# EAGLE design TDA2822M (EAGLE 7.0.0)
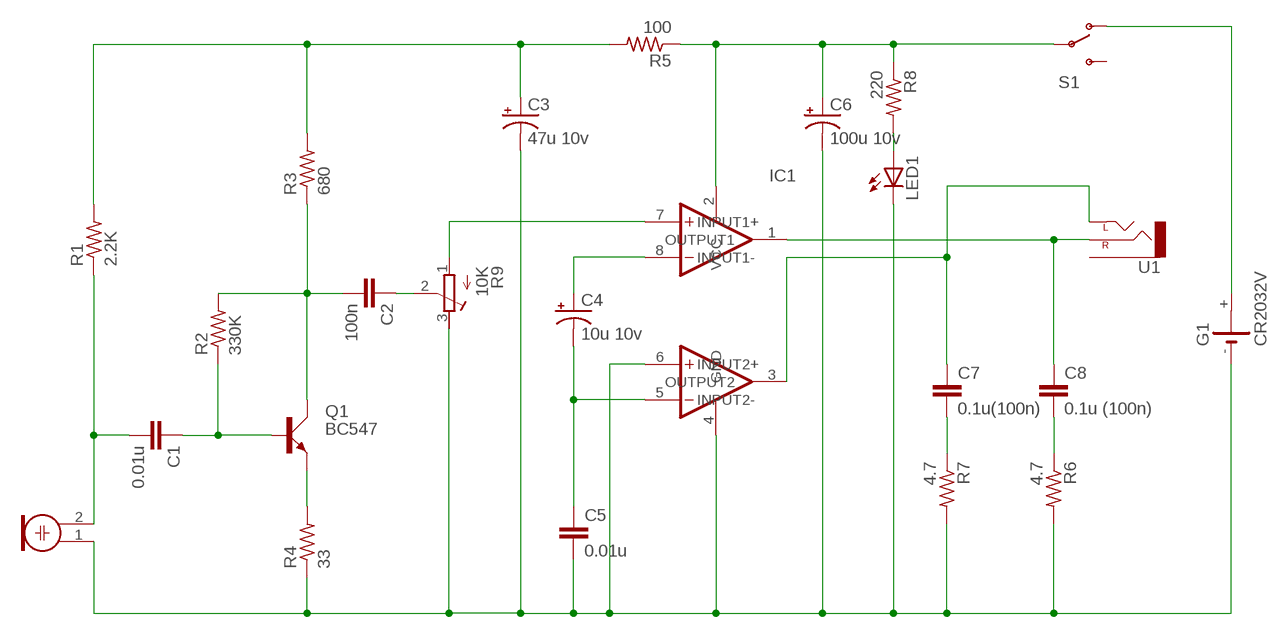
[diagram p0: schematic, sheet 1]

## Parts
C1  0.01u  CAPPTH  [CAP-PTH-SMALL]
C2  100n  CAPPTH  [CAP-PTH-SMALL]
C3  47u 10v  CAP_POLPTH2  [CPOL-RADIAL-10UF-25V]
C4  10u 10v  CAP_POLPTH2  [CPOL-RADIAL-10UF-25V]
C5  0.01u  CAPPTH  [CAP-PTH-SMALL]
C6  100u 10v  CAP_POLPTH2  [CPOL-RADIAL-10UF-25V]
C7  0.1u(100n)  CAPPTH  [CAP-PTH-SMALL]
C8  0.1u (100n)  CAPPTH  [CAP-PTH-SMALL]
G1  CR2032V  [CR2032V]
IC1  TDA2822M  [DIL8]
LED1  LED3MM  [LED3MM]
M1  ELECTRET_MICROPHON-F6035AP  [F6035AP]
Q1  BC547  [SOT54A]
R1  2.2K  R-US_0204/7  [0204/7]
R2  330K  R-US_0204/7  [0204/7]
R3  680  R-US_0204/7  [0204/7]
R4  33  R-US_0204/7  [0204/7]
R5  100  R-US_0204/7  [0204/7]
R6  4.7  R-US_0204/7  [0204/7]
R7  4.7  R-US_0204/7  [0204/7]
R8  220  R-US_0204/7  [0204/7]
R9  10K  R-TRIMM3339P  [RTRIM3339P]
S1  SWITCH-SPSTKIT  [SWITCH-SPDT_KIT]
U1  AUDIO-JACKPTH  [AUDIO-JACK]

## Nets
GND: C3.2(-) C5.2 C6.2(-) G1.- IC1.4(GND) IC1.6(INPUT2+) LED1.K(C) M1.1 R4.1 R6.2 R7.2 R9.3(A)
N$1: C3.1(+) R1.2 R3.2 R5.2
N$2: C2.2 Q1.C R2.2 R3.1
N$3: C1.2 M1.2 R1.1
N$5: Q1.E R4.2
N$6: C2.1 R9.2(S)
N$8: C4.2(-) C5.1 IC1.5(INPUT2-)
N$9: C7.2 R7.1
N$10: C8.2 R6.1
N$11: LED1.A R8.2
N$12: C6.1(+) IC1.2(VCC) R5.1 R8.1 S1.2(P)
N$13: C8.1 IC1.1(OUTPUT1) U1.RING(RIGHT)
N$15: C1.1 Q1.B R2.1
N$16: C4.1(+) IC1.8(INPUT1-)
N$17: IC1.7(INPUT1+) R9.1(E)
N$18: C7.1 IC1.3(OUTPUT2) U1.TIP(LEFT)
VCC: G1.+ S1.1(O)
Unconnected: G1.+@1(+) S1.3(S) U1.SLEEVE

## Library data of the parts
C1 C2 C5 C7 C8 = SparkFun:CAP: Capacitor Standard 0603 ceramic capacitor, and 0.1" leaded capacitor.
C3 C4 C6 = SparkFun:CAP_POL: Capacitor Polarized These are standard SMD and PTH capacitors. Normally 10uF, 47uF, and 100uF in electrolytic and tantalum varieties. Always verify the external diameter of the through hole cap, it varies with capacity, voltage, and manufacturer. The EIA devices should be standard.
G1 = battery:CR2032V: LI BATTERY Varta
IC1 = TDA2822M:TDA2822M: TDA2822M - DUAL LOW-VOLTAGE POWER AMPLIFIER
LED1 = adafruit:LED: LED OSRAM: - CHIPLED LG R971, LG N971, LY N971, LG Q971, LY Q971, LO R971, LY R971 LH N974, LH R974 LS Q976, LO Q976, LY Q976 LO Q996 - Hyper CHIPLED LW Q18S LB Q993, LB Q99A, LB R99A - SideLED LS A670, LO A670, LY A670, LG A670, LP A670 LB A673, LV A673, LT A673, LW A673 LH A674 LY A675 LS A676, LA A676, LO A676, LY A676, LW A676 LS A679, LY A679, LG A679 - Hyper Micro SIDELED® LS Y876, LA Y876, LO Y876, LY Y876 LT Y87S - SmartLED LW L88C, LW L88S LB L89C, LB L89S, LG L890 LS L89K, LO L89K, LY L89K LS L896, LA L896, LO L896, LY L896 - TOPLED LS T670, LO T670, LY T670, LG T670, LP T670 LSG T670, LSP T670, LSY T670, LOP T670, LYG T670 LG T671, LOG T671, LSG T671 LB T673, LV T673, LT T673, LW T673 LH T674 LS T676, LA T676, LO T676, LY T676, LB T676, LH T676, LSB T676, LW T676 LB T67C, LV T67C, LT T67C, LS T67K, LO T67K, LY T67K, LW E67C LS E67B, LA E67B, LO E67B, LY E67B, LB E67C, LV E67C, LT E67C LW T67C LS T679, LY T679, LG T679 LS T770, LO T770, LY T770, LG T770, LP T770 LB T773, LV T773, LT T773, LW T773 LH T774 LS E675, LA E675, LY E675, LS T675 LS T776, LA T776, LO T776, LY T776, LB T776 LHGB T686 LT T68C, LB T68C - Hyper Mini TOPLED® LB M676 - Mini TOPLED Santana® LG M470 LS M47K, LO M47K, LY M47K Source: http://www.osram.convergy.de/
M1 = microphon:ELECTRET_MICROPHON-: Electret Condenser Microphone
Q1 = transistor-small-signal:BC547: NPN TRANSISTOR
R1-R8 = adafruit:R-US_: RESISTOR, American symbol
R9 = resistor:R-TRIMM: Trimm resistor
S1 = SparkFun:SWITCH-SPST: SPST Switch Simple slide switch. Spark Fun Electronics SKU : COM-00102
U1 = SparkFun:AUDIO-JACK: 3.5mm Audio Jack Simple 3.5mm common PCB mount audio jack. SKU: PRT-08032

## Net classes
0 default: width 0.762 mm, drill 0.508 mm, clearance 0.762 mm

## Board
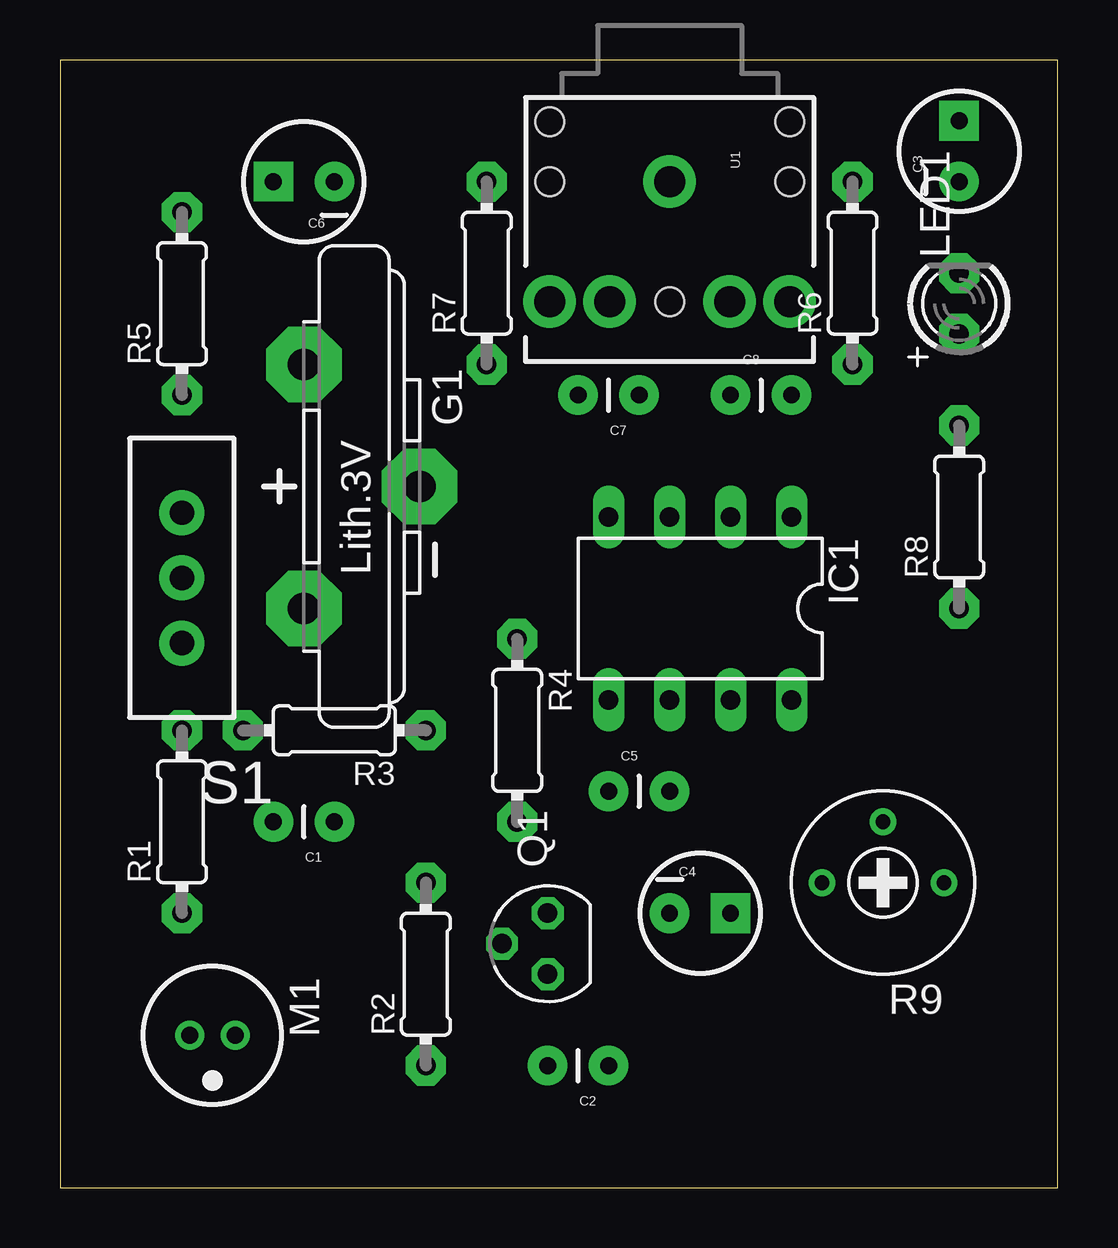
[diagram p1: board, top side]
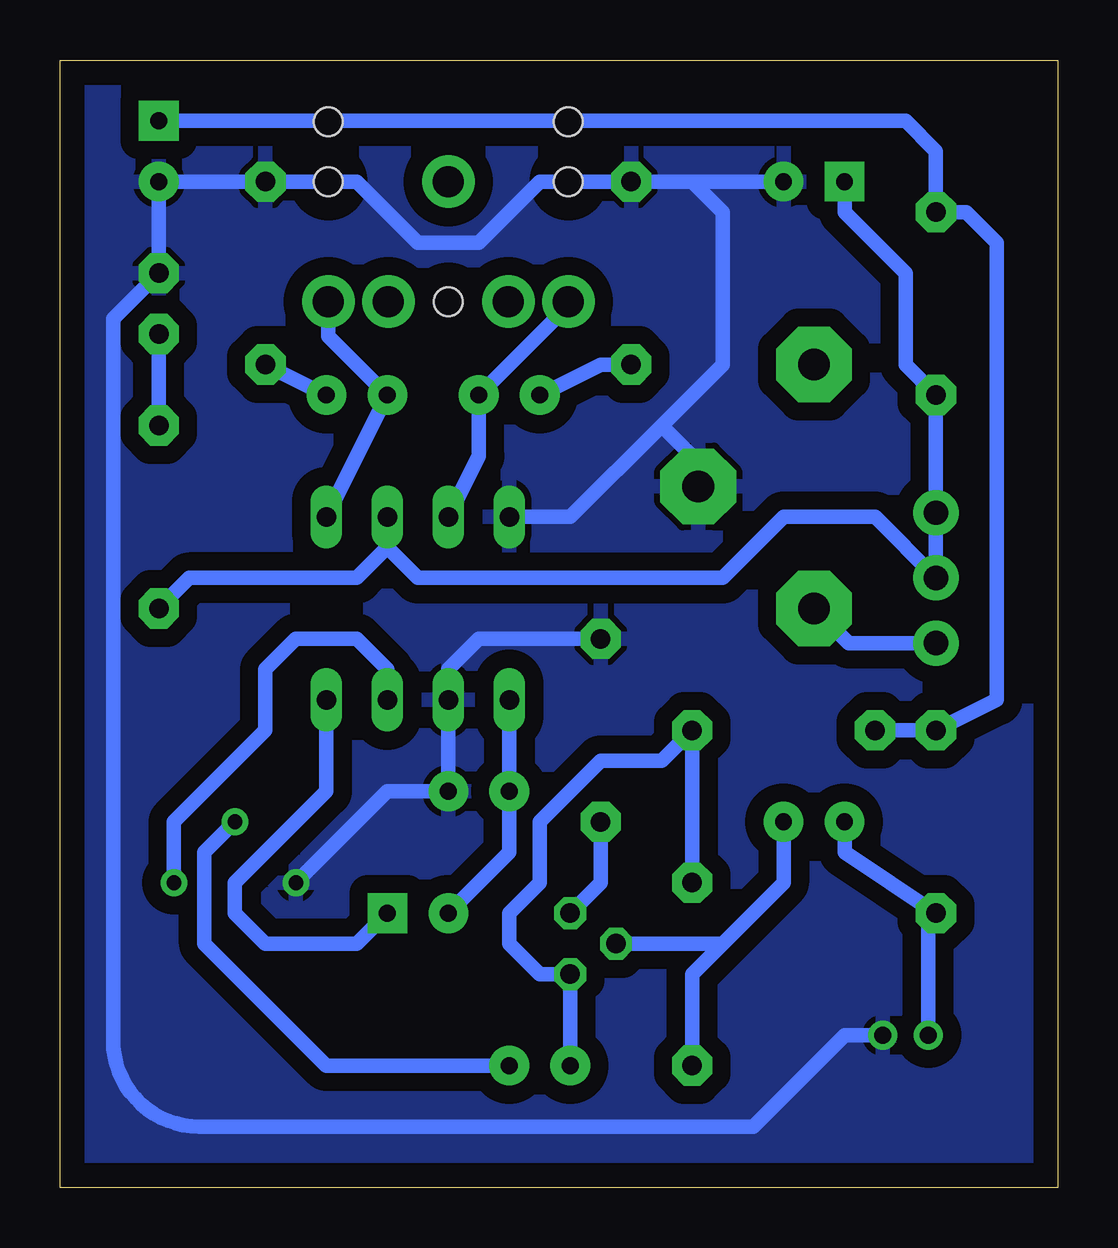
[diagram p2: board, bottom side, seen from below]

Size 41.58 x 46.98 mm. Coordinates in mm from the lower left corner, seen from the top.
Outline: 0,0 41.58,0 41.58,46.98 0,46.98 0,0
Copper layers (1*16): Top 0.035mm / dielectric 1.5mm / Bottom 0.035mm
Design rules "default *": minimum track width 12mil, minimum drill 24mil, track to track 8mil, track to pad 8mil, pad to pad 8mil, via to via 8mil, smd to smd 8mil, copper to edge 40mil, drill to drill 8mil, minimum pad ring 10mil, minimum via ring 8mil, stop-mask expansion 4mil, vias tented up to drill 0mil, thermal gap 10mil

### Footprints (pad centres in the part's own frame; a part is rotated, then mirrored left to right if it is on the bottom)
CAP-PTH-SMALL = drill 0.7 pad 1.651: 1 0,0; 2 2.54,0
CPOL-RADIAL-10UF-25V = drill 0.7 pad 1.651 square: 1 1.27,0 | drill 0.7 pad 1.651: 2 -1.27,0
CR2032V = drill 1.321 pad 3.15 octagon: + -2.54,-5.08; +@1 -2.54,5.08; - 2.286,0
DIL8 = drill 0.813 long: 1 -3.81,-3.81; 2 -1.27,-3.81; 3 1.27,-3.81; 4 3.81,-3.81; 5 3.81,3.81; 6 1.27,3.81; 7 -1.27,3.81; 8 -3.81,3.81
LED3MM = drill 0.813 pad 1.676 octagon: A -1.27,0; K 1.27,0
F6035AP = drill 0.7 pad 1.2: 1 0,0.95; 2 0,-0.95
SOT54A = drill 0.813 octagon: B 0,1.905; C -1.27,0; E 1.27,0
0204/7 = drill 0.813 pad 1.676 octagon: 1 -3.81,0; 2 3.81,0
RTRIM3339P = drill 0.61: 1 -2.54,0; 2 0,-2.54; 3 2.54,0
SWITCH-SPDT_KIT = drill 1.016 pad 1.88: 1 0,2.718; 2 0,0; 3 0,-2.718
AUDIO-JACK = drill 1.3 pad 2.184: RING 5,5; RSH 5,2.5; SLEEVE 0,0; TIP 5,-5; TSH 5,-2.5 | hole 1.2: 0,5; -2.5,5; -2.5,-5; 0,-5; 5,0

### Placement (x,y rotation side)
C1  11.43,15.24 180 top
C2  22.86,5.08 180 top
C3  37.47,43.18 90 top
C4  26.67,11.43 0 top
C5  22.86,16.51 0 top
C6  10.16,41.91 180 top
C7  24.13,33.02 180 top
C8  27.94,33.02 0 top
G1  12.7,29.21 0 top
IC1  26.67,24.13 180 top
LED1  37.47,36.83 90 top
M1  6.35,6.35 270 top
Q1  20.32,10.16 90 top
R1  5.08,15.24 90 top
R2  15.24,8.89 90 top
R3  11.43,19.05 180 top
R4  19.05,19.05 270 top
R5  5.08,36.83 90 top
R6  33.02,38.1 90 top
R7  17.78,38.1 90 top
R8  37.47,27.94 90 top
R9  34.29,12.7 180 top
S1  5.08,25.4 180 top
U1  25.4,41.91 270 top

### Tracks (layer width: path | path; a pad name or v marks a point on that pad's centre or on a via)
GND
  Bottom 0.61: C6.2 15.24,41.91 | 15.24,41.91 R7.2 21.59,41.91 24.13,39.37 26.67,39.37 29.21,41.91 R6.2 C3.2 LED1.K 39.37,36.19 39.37,6.13 arc-90 35.78,2.54 12.7,2.54 8.89,6.35 M1.1 | R9.3 27.94,16.51 C5.2 IC1.6 25.4,21.59 24.13,22.86 R4.1 | IC1.4 20.32,27.94 16.51,31.75 | 16.51,31.75 13.97,34.29 13.97,40.64 15.24,41.91 | G1.- 14.99,30.23 16.51,31.75
  pour Bottom: 0,46.99 41.91,46.99 41.91,0 0,0
N$1
  Bottom 0.61: C3.1 6.35,44.45 5.08,43.18 R5.2 3.81,40.64 2.54,39.37 2.54,20.32 R1.2 R3.2
N$2
  Bottom 0.61: C2.2 Q1.C 21.59,8.89 22.86,10.16 22.86,11.43 21.59,12.7 21.59,15.24 19.05,17.78 16.51,17.78 R3.1 R2.2
N$3
  Bottom 0.61: C1.2 8.89,13.97 R1.1 5.4,11.11 M1.2
N$5
  Bottom 0.61: R4.2 19.05,12.7 Q1.E
N$6
  Bottom 0.61: C2.1 30.48,5.08 35.56,10.16 35.56,13.97 R9.2
N$8
  Bottom 0.61: C4.2 22.86,13.97 C5.1 IC1.5
N$9
  Bottom 0.61: R7.1 19.05,34.29 C7.2
N$10
  Bottom 0.61: C8.2 R6.1
N$11
  Bottom 0.61: R8.2 LED1.A
N$12
  Bottom 0.61: 27.94,26.67 29.21,25.4 36.2,25.4 R8.1 | C6.1 8.89,40.64 6.35,38.1 6.35,34.29 R5.1 S1.2 7.62,27.94 11.43,27.94 13.97,25.4 26.67,25.4 27.94,26.67 | IC1.2 27.94,26.67
N$13
  Bottom 0.61: U1.RING 30.4,35.48 C8.1 IC1.1
N$15
  Bottom 0.61: C1.1 11.43,12.7 13.97,10.16 | 13.97,10.16 Q1.B | R2.1 15.24,8.89 13.97,10.16
N$16
  Bottom 0.61: IC1.8 30.48,16.51 34.29,12.7 34.29,11.43 33.02,10.16 29.21,10.16 C4.1
N$17
  Bottom 0.61: IC1.7 27.94,21.59 29.21,22.86 31.75,22.86 33.02,21.59 33.02,19.05 36.83,15.24 R9.1
N$18
  Bottom 0.61: U1.TIP 20.4,36.75 C7.1 24.13,30.48 IC1.3
VCC
  Bottom 0.61: S1.1 8.71,22.68 G1.+